# EAGLE design zumo_V1_FABRICATED_enc_only (EAGLE 8.3.1)
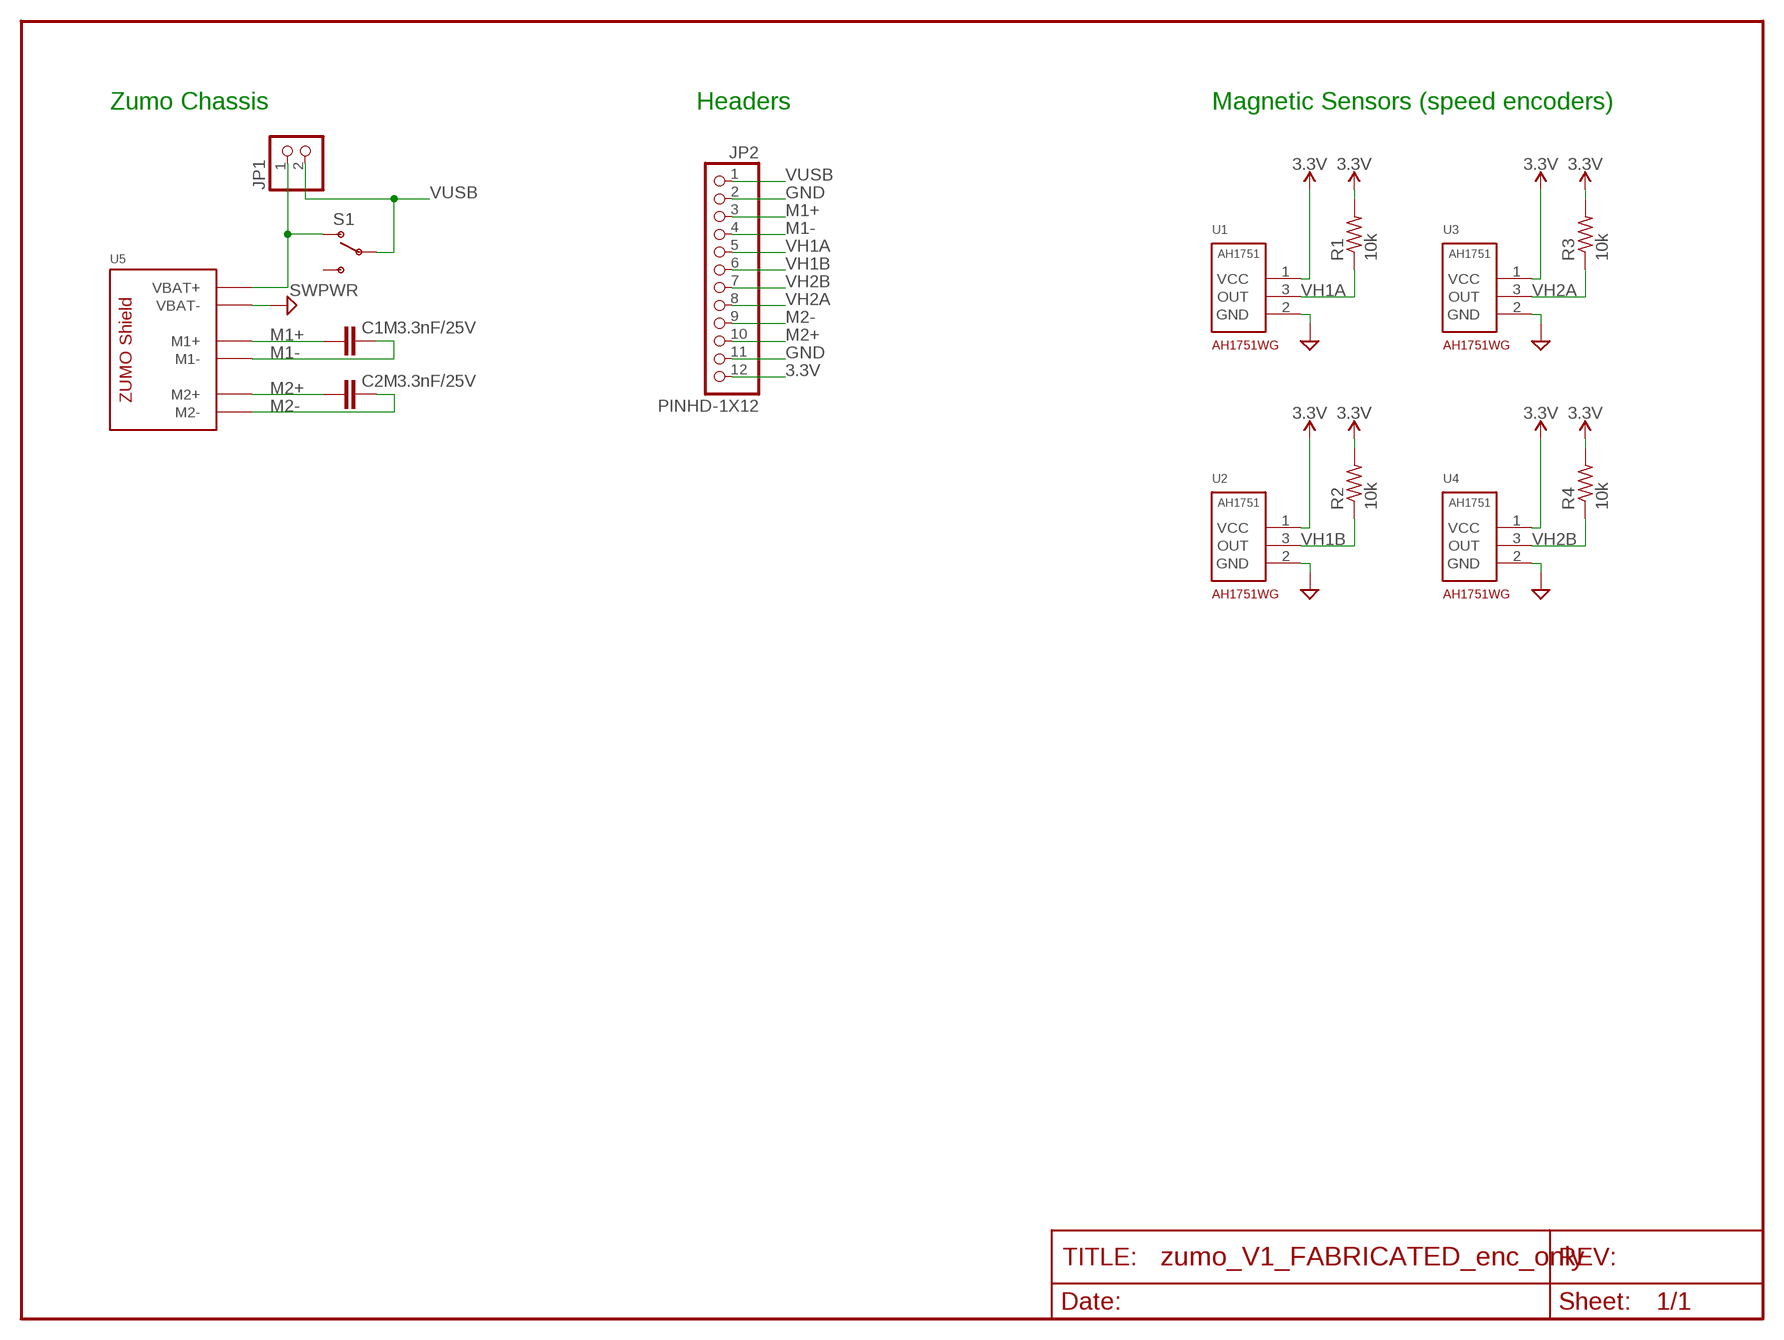
[diagram p0: schematic, sheet 1]

## Parts
C1M  3.3nF/25V  CAPACITORC0805  [C0805]
C2M  3.3nF/25V  CAPACITORC0805  [C0805]
JP1  JPWR  PINHD-1X2  [1X02]
JP2  PINHD-1X12  [1X12]
R1  10k  RESISTORR0805  [R0805]
R2  10k  RESISTORR0805  [R0805]
R3  10k  RESISTORR0805  [R0805]
R4  10k  RESISTORR0805  [R0805]
S1  SWPWR  SWITCH-SPSTSMD  [AYZ0202]
U1  AH1751WG  [SC59]
U2  AH1751WG  [SC59]
U3  AH1751WG  [SC59]
U4  AH1751WG  [SC59]
U5  ZUMONO_TABS  [ZUMO_NO_TABS]

## Nets
3.3V: JP2.12 R1.2 R2.2 R3.2 R4.2 U1.1(VCC) U2.1(VCC) U3.1(VCC) U4.1(VCC)
GND: JP2.2 JP2.11 U1.2(GND) U2.2(GND) U3.2(GND) U4.2(GND) U5.VBAT-
M1+: C1M.2 JP2.3 U5.M1+
M1-: C1M.1 JP2.4 U5.M1-
M2+: C2M.2 JP2.10 U5.M2+
M2-: C2M.1 JP2.9 U5.M2-
VBAT: JP1.1 S1.1(O) U5.VBAT+
VH1A: JP2.5 R1.1 U1.3(OUT)
VH1B: JP2.6 R2.1 U2.3(OUT)
VH2A: JP2.8 R3.1 U3.3(OUT)
VH2B: JP2.7 R4.1 U4.3(OUT)
VUSB: JP1.2 JP2.1 S1.2(P)
Unconnected: S1.3(S)

## Notes on the sheet
- Zumo Chassis | Headers | Magnetic Sensors (speed encoders)

## Library data of the parts
C1M C2M = EE49:CAPACITOR: CAPACITOR, European symbol; DIGIKEY: 732-8052-6-ND
JP1 = zumo:PINHD-1X2: PIN HEADER
JP2 = zumo:PINHD-1X12: PIN HEADER
R1-R4 = EE49:RESISTOR: RESISTOR, American symbol
S1 = SparkFun:SWITCH-SPST: SPST Switch Simple slide switch. Spark Fun Electronics SKU : COM-00102; DIGIKEY: 401-2013-6-ND
U1-U4 = zumo:AH1751; DIGIKEY: AH1751-WG-7-ADIDKR-ND
U5 = zumo:ZUMO: ZUMO Robot Chassis Shield Includes board outline, terminals for battery, motors (2), and mounting holes. Also indicates areas permissible for through-hole components. Locations for hall senensors (e.g. AH1751 in SC59 package) indicated on bDocu layer. Pololu Zumo Chassis <https://www.pololu.com/product/1418>

## Board
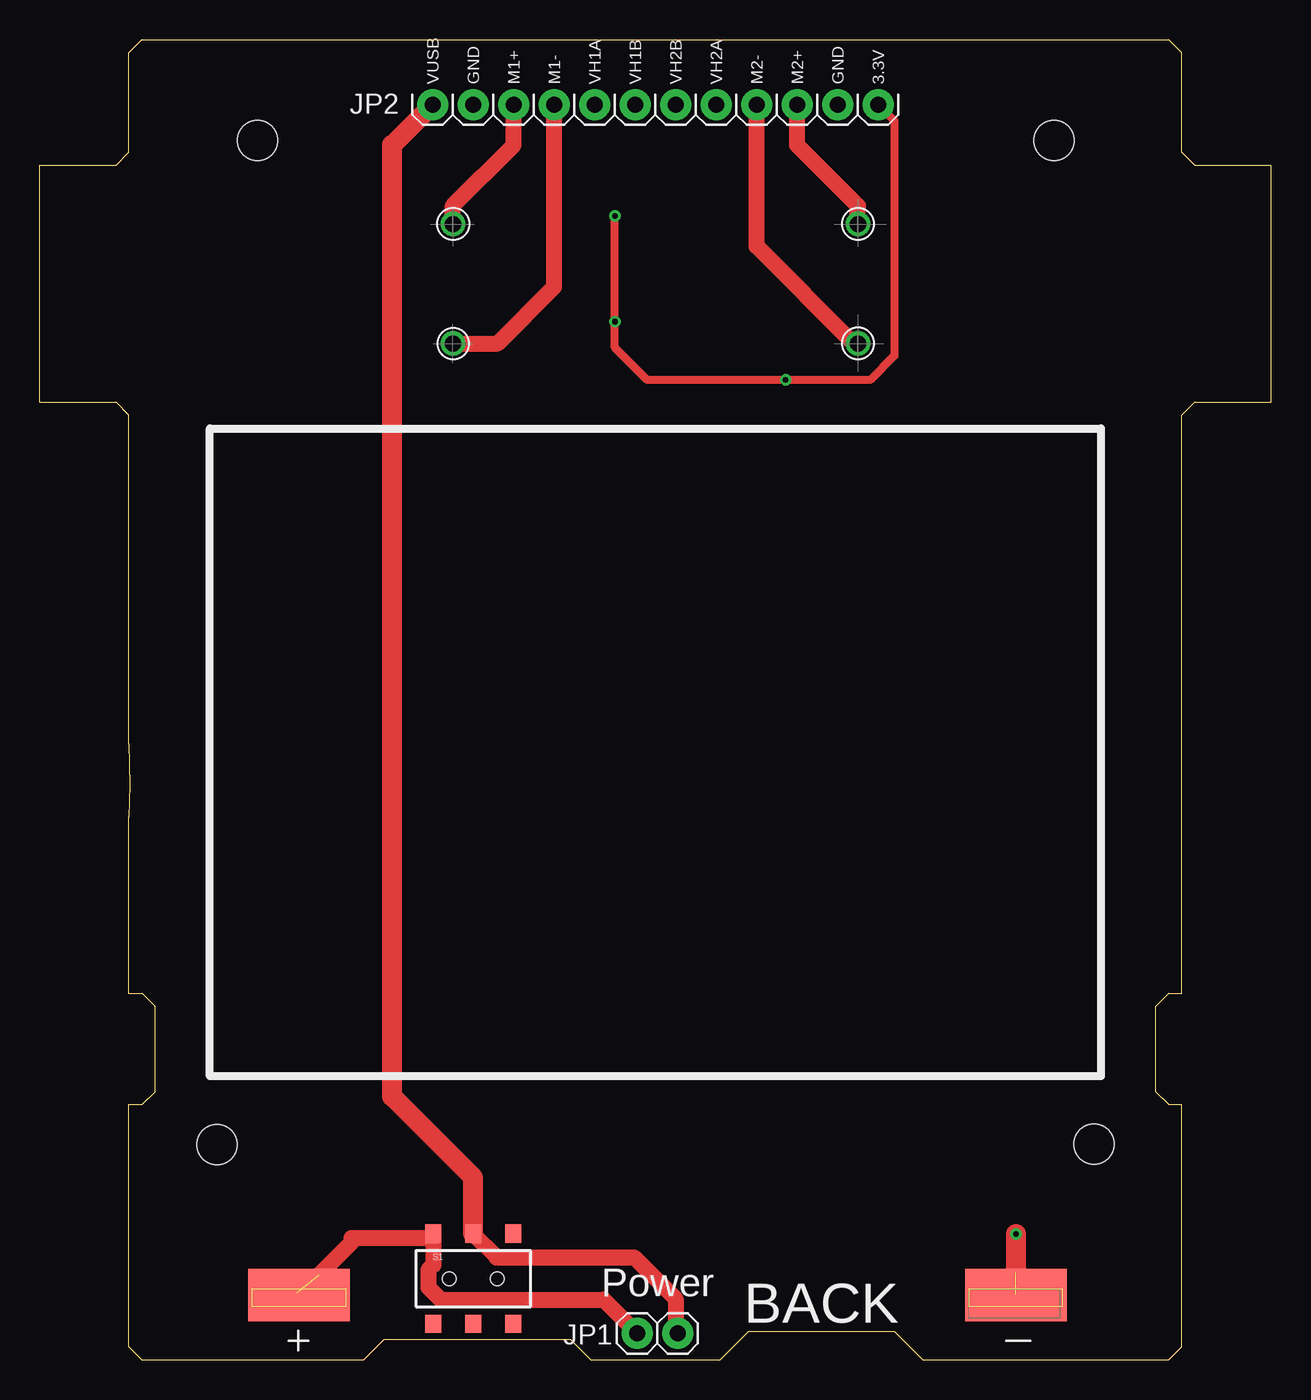
[diagram p1: board, top side]
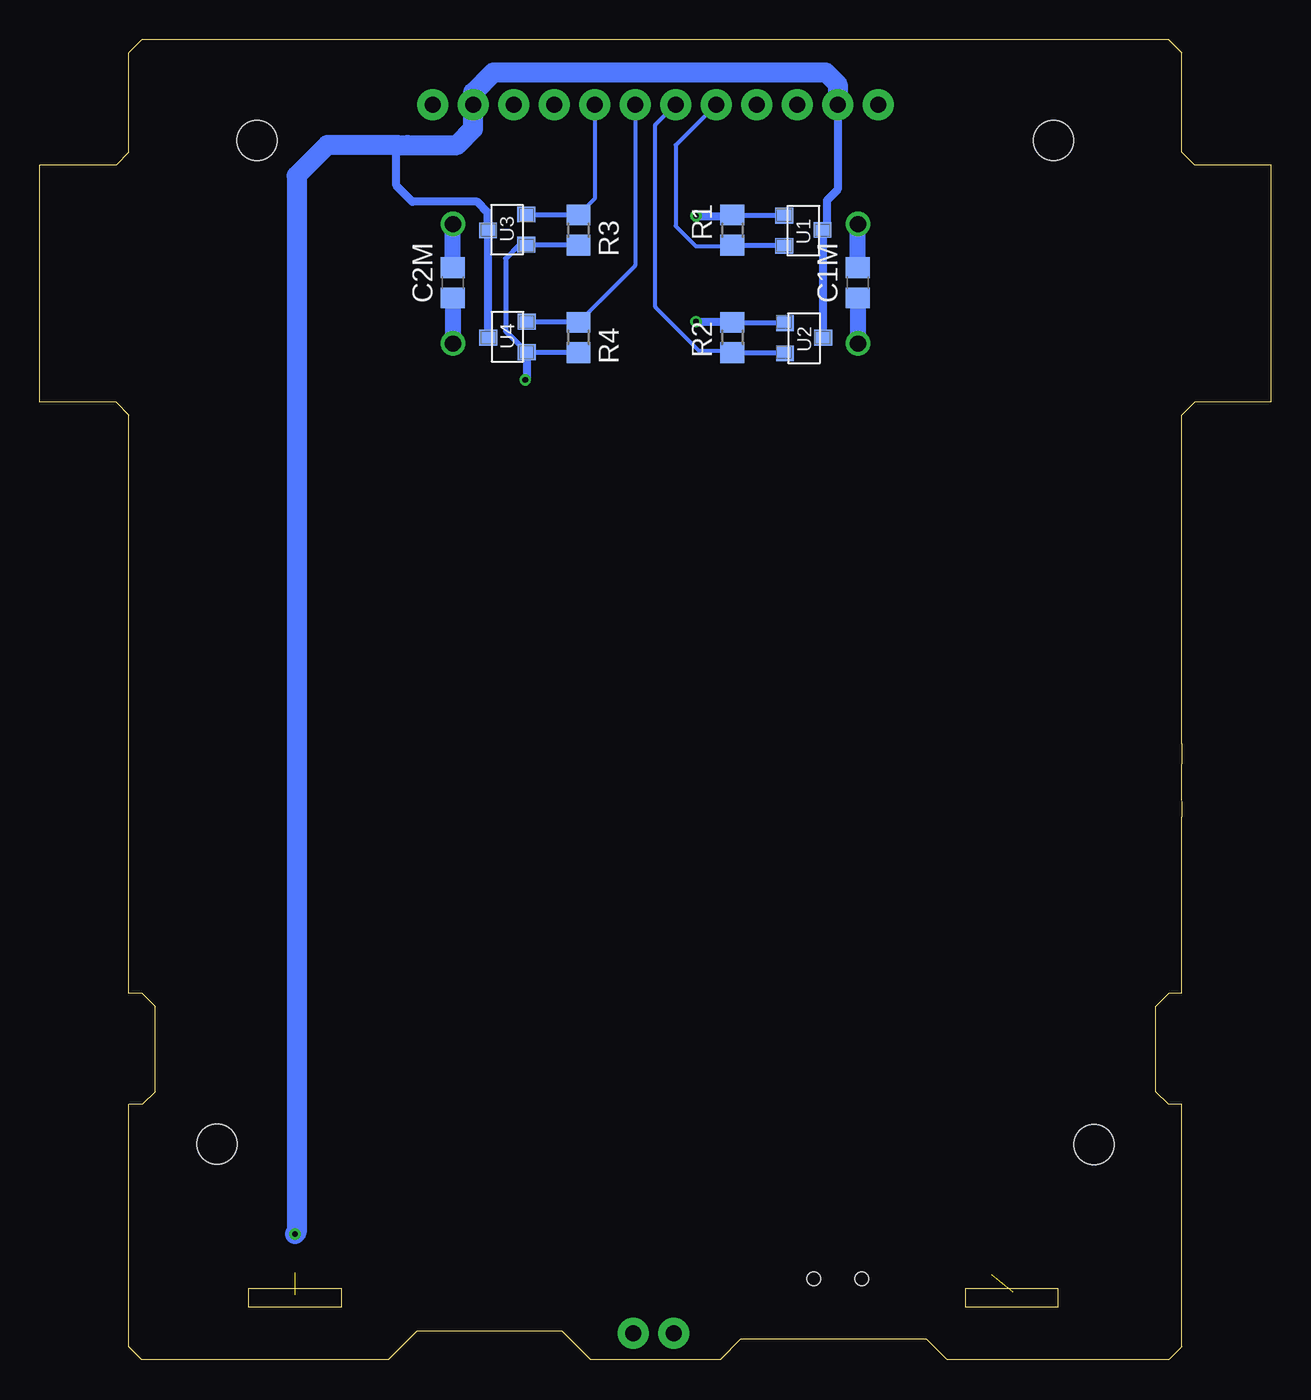
[diagram p2: board, bottom side, seen from below]

Size 77.22 x 82.8 mm. Coordinates in mm from the lower left corner, seen from the top.
Copper layers (1*16): Top 0.0356mm / dielectric 1.5011mm / Bottom 0.0356mm
Design rules "oshpark-2layer": minimum track width 6mil, minimum drill 13mil, track to track 6mil, track to pad 6mil, pad to pad 6mil, via to via 6mil, smd to smd 6mil, copper to edge 15mil, drill to drill 6mil, minimum pad ring 7mil, minimum via ring 7mil, stop-mask expansion 2.5mil, vias tented up to drill 0mil, thermal gap 10mil

### Footprints (pad centres in the part's own frame; a part is rotated, then mirrored left to right if it is on the bottom)
C0805 = smd 1.3 x 1.5: 1 -0.95,0; 2 0.95,0
1X02 = drill 1.016 pad 1.93: 1 -1.27,0; 2 1.27,0
1X12 = drill 1.016 pad 1.93: 1 -13.97,0; 2 -11.43,0; 3 -8.89,0; 4 -6.35,0; 5 -3.81,0; 6 -1.27,0; 7 1.27,0; 8 3.81,0; 9 6.35,0; 10 8.89,0; 11 11.43,0; 12 13.97,0
R0805 = smd 1.3 x 1.5: 1 -0.95,0; 2 0.95,0
AYZ0202 = smd 1 x 1.15: 1 -2.5,2.825; 2 0,2.825; 3 2.5,2.825; 4 -2.5,-2.825; 5 0,-2.825; 6 2.5,-2.825 | hole 0.85: 1.5,0; -1.5,0
SC59 = smd 0.991 x 1.118: 1 0,0; 2 0.899,2.403; 3 1.9,0
ZUMO_NO_TABS = drill 1.016: M1+ 34.29,71.247; M1- 34.29,63.754; M2+ 59.69,71.247; M2- 59.69,63.754 | smd 6.35 x 3.302: VBAT+ 24.638,4.064; VBAT- 69.596,4.064 | hole 2.5: 71.984,76.505; 74.498,13.513; 19.482,13.487; 22.022,76.505

### Placement (x,y rotation side)
C1M  25.91,67.56 90 bottom
C2M  51.31,67.56 90 bottom
JP1  38.73,1.65 0 top
JP2  38.61,78.74 0 top
R1  33.78,70.87 90 bottom
R2  33.78,64.14 90 bottom
R3  43.43,70.87 270 bottom
R4  43.43,64.14 270 bottom
S1  27.18,5.08 0 top
U1  30.53,71.78 270 bottom
U2  30.48,65.03 270 bottom
U3  46.71,69.95 90 bottom
U4  46.69,63.22 90 bottom
U5  -8.38,0 0 top

### Tracks (layer width: path | path; a pad name or v marks a point on that pad's centre or on a via)
3.3V  (via drill 0.35)
  Top 0.508: JP2.12 53.59,77.72 53.59,62.99 52.07,61.47 v46.77,61.47 38.1,61.47 36.07,63.5 v36.07,65.13 v36.07,71.75
  Bottom 0.152: 46.63,63.4 U4.1 | 46.79,69.8 46.73,69.91 U3.1
  Bottom 0.254: U4.1 46.62,63.28 | 46.64,70.02 U3.1
  Bottom 0.305: U2.1 33.73,65.03 R2.2 | R1.2 30.57,71.82 U1.1 | R4.2 46.65,63.19 U4.1 48.01,64.54 48.01,69.09 47.15,69.95 U3.1 | R3.2 46.72,69.92 46.73,69.91
  Bottom 0.508: U4.1 46.69,61.56 v46.77,61.47 | v36.07,71.75 33.84,71.75 R1.2 | R2.2 36.03,65.08 v36.07,65.13
GND  (via drill 0.35)  (1 unrouted)
  Top 1.27: v61.21,7.87 61.21,5.46
  Bottom 0.254: 54.1,76.15 54.15,76.2 | 49.11,64.14 U4.2
  Bottom 0.508: JP2.2 27.18,73.41 27.86,72.72 27.86,71.14 U1.2 28.13,64.18 U2.2 | U4.2 49.09,70.82 U3.2 49.11,71.97 49.78,72.64 53.85,72.64 54.86,73.66 54.86,76.14 54.8,76.2
  Bottom 1.27: JP2.2 27.18,80.01 27.94,80.77 48.77,80.77 50.04,79.5 JP2.11 50.04,77.22 51.05,76.2 54.15,76.2 54.8,76.2 59.18,76.2 61.11,74.27 61.11,7.98 v61.21,7.87
M1+
  Top 1.016: U5.M1+ 25.91,72.39 29.72,76.2 JP2.3
  Bottom 1.016: C1M.2 U5.M1+
M1-
  Top 1.016: U5.M1- 28.7,63.75 32.26,67.31 JP2.4
  Bottom 1.016: C1M.1 U5.M1-
M2+
  Top 1.016: U5.M2+ 51.31,72.39 47.5,76.2 JP2.10
  Bottom 1.016: C2M.2 U5.M2+
M2-
  Top 1.016: U5.M2- 51.05,63.75 44.96,69.85 JP2.9
  Bottom 1.016: C2M.1 U5.M2-
VBAT  (1 unrouted)
  Top 1.016: U5.VBAT+ 16.15,4.22 | JP1.1 35.35,3.77 25.13,3.77 24.36,4.54 24.36,5.62 24.68,5.94 S1.1 24.39,7.62 19.56,7.62 19.56,7.37 17.53,5.33
VH1A
  Bottom 0.254: R1.1 33.85,69.85 36.07,69.85 37.34,71.12 37.34,76.2 JP2.5
  Bottom 0.305: R1.1 30.57,69.92 U1.3
VH1B
  Bottom 0.254: U2.3 30.64,63.28 | R2.1 33.88,63.28 35.85,63.28 38.61,66.04 38.61,77.47 JP2.6
  Bottom 0.305: R2.1 30.54,63.19 U2.3
VH2A
  Bottom 0.254: R3.1 42.42,72.83 JP2.8
  Bottom 0.305: R3.1 46.68,71.82 U3.3
VH2B
  Bottom 0.254: U4.3 46.55,64.98 | JP2.7 39.88,68.64 R4.1
  Bottom 0.305: R4.1 46.65,65.08 U4.3
VUSB
  Top 1.016: S1.2 27.16,7.91 28.65,6.42 37.27,6.42 39.88,3.81 39.88,1.78 JP1.2
  Top 1.27: S1.2 27.18,11.43 22.1,16.51 22.1,76.2 JP2.1

### Text on the board
tPlace: VUSB | GND | M1+ | M1- | VH1A | VH1B | VH2B | VH2A | M2- | M2+ | GND | 3.3V | Power | BACK